# EAGLE schematic SCX3 (EAGLE 7.7.0)
PROJECT_NAME: ServoControllerX3; VERSION: 1.2.0

## Sheet 1 of 7: Power P
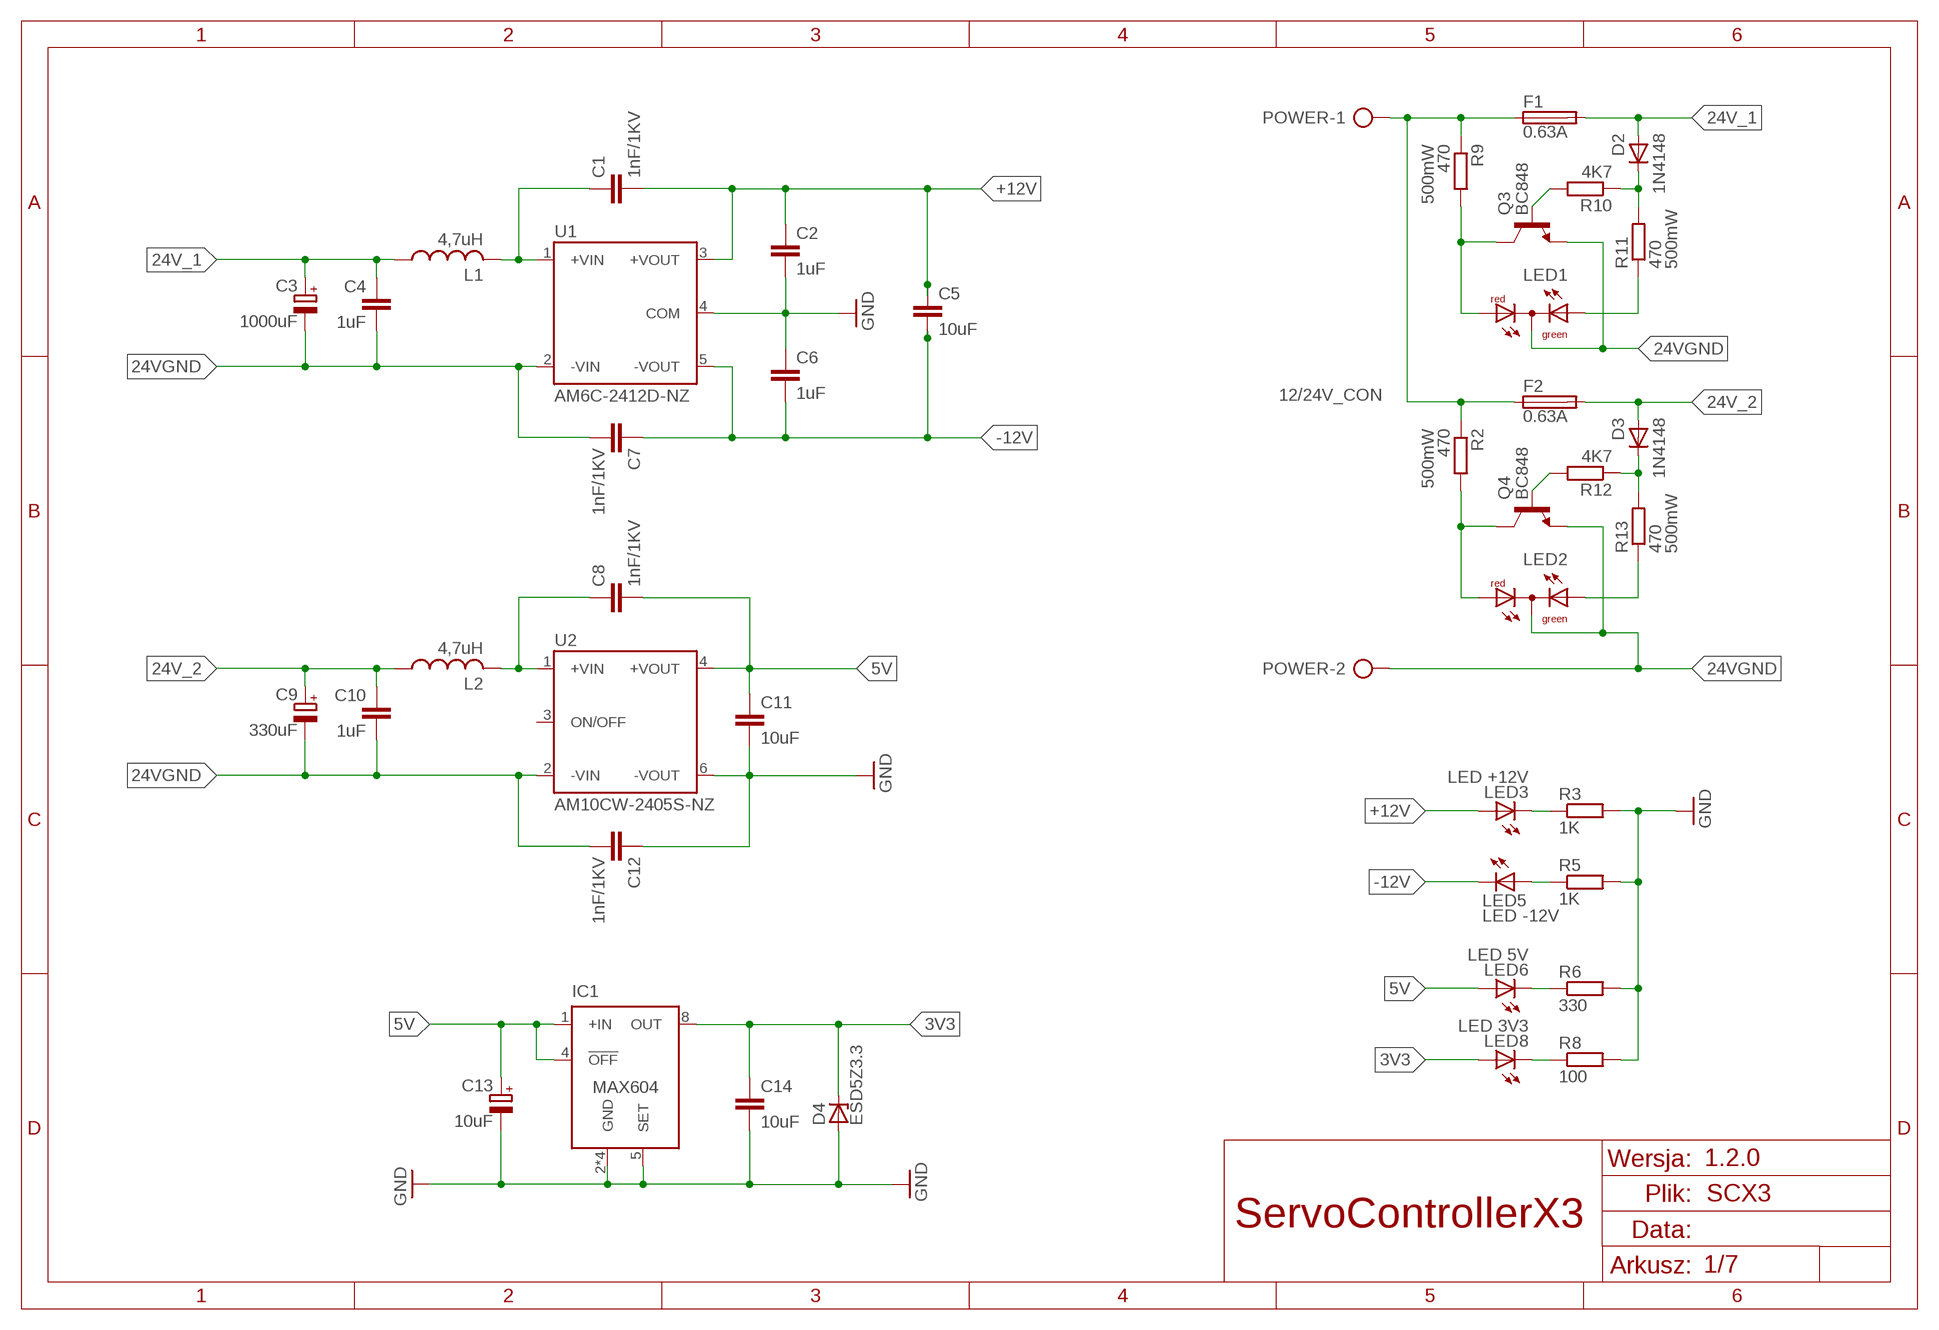
[diagram p0: schematic, sheet 1]

### Parts
C1  1nF/1KV  C-EUC1206  [C1206]
C2  1uF  C-EUC0805  [C0805]
C3  1000uF  CPOL-EUE5-10.5  [E5-10,5]
C4  1uF  C-EUC0805  [C0805]
C5  10uF  C-EUC0805  [C0805]
C6  1uF  C-EUC0805  [C0805]
C7  1nF/1KV  C-EUC1206  [C1206]
C8  1nF/1KV  C-EUC1206  [C1206]
C9  330uF  CPOL-EUE5-10.5  [E5-10,5]
C10  1uF  C-EUC0805  [C0805]
C11  10uF  C-EUC0805  [C0805]
C12  1nF/1KV  C-EUC1206  [C1206]
C13  10uF  CPOL-EUUD-4X5,8  [UD-4X5,8_NICHICON]
C14  10uF  C-EUC0805  [C0805]
D2  1N4148  1N4148SMD-0805  [D0805]
D3  1N4148  1N4148SMD-0805  [D0805]
D4  ESD5Z3.3  ZENER-DIODESOD523  [SOD523]
F1  0.63A  TR5  [TR5]
F2  0.63A  TR5  [TR5]
IC1  MAX604  [DIL08]
L1  4,7uH  DJNR6028--S  [DJNR6028]
L2  4,7uH  DJNR6028--S  [DJNR6028]
LED1  DUOLED-RG-C  [DUOLED-C-5MM]
LED2  DUOLED-RG-C  [DUOLED-C-5MM]
LED3  LED +12V  LEDSML1206  [SML1206]
LED5  LED -12V  LEDSML1206  [SML1206]
LED6  LED 5V  LEDSML1206  [SML1206]
LED8  LED 3V3  LEDSML1206  [SML1206]
POWER  12/24V_CON  AK500/2  [AK500/2]
Q3  BC848  BC848SMD  [SOT23]
Q4  BC848  BC848SMD  [SOT23]
R2  470  R-EU_R1206  [R1206]
R3  1K  R-EU_R0805  [R0805]
R5  1K  R-EU_R0805  [R0805]
R6  330  R-EU_R0805  [R0805]
R8  100  R-EU_R0805  [R0805]
R9  470  R-EU_R1206  [R1206]
R10  4K7  R-EU_R0805  [R0805]
R11  470  R-EU_R1206  [R1206]
R12  4K7  R-EU_R0805  [R0805]
R13  470  R-EU_R1206  [R1206]
U1  AM6C-2412D-NZ  [AM6C]
U2  AM10CW-2405S-NZ  [AM10CW-NZ]

### Nets
3V3: C14.1 D4.C IC1.8(OUT) LED8.A ; also sheet 2,3,4,6,7
5V: C8.2 C11.1 C13.+ IC1.1(+IN) IC1.4(!OFF) LED6.A U2.4(+VOUT) ; also sheet 2,3,4
24V_1: C3.+ C4.1 D2.1(A) F1.2 L1.A
24V_2: C9.+ C10.1 D3.1(A) F2.2 L2.A
24V_SUPPLY: F1.1 F2.1 POWER.1 R2.1 R9.1
24VGND [24V]: C3.- C4.2 C7.2 C9.- C10.2 C12.2 LED1.C LED2.C POWER.2 Q3.2(E) Q4.2(E) U1.2(-VIN) U2.2(-VIN)
+12V [12V]: C1.2 C2.1 C5.1 LED3.A U1.3(+VOUT) ; also sheet 5
-12V [12V]: C5.2 C6.2 C7.1 LED5.C U1.5(-VOUT) ; also sheet 5
GND: C2.2 C6.1 C11.2 C12.1 C13.- C14.2 D4.A IC1.2(GND) IC1.3(GND) IC1.5(SET) IC1.6(GND) IC1.7(GND) R3.2 R5.2 R6.2 R8.2 U1.4(COM) U2.6(-VOUT) ; also sheet 2,3,4,5,6,7
N$4: C8.1 L2.B U2.1(+VIN)
N$46: C1.1 L1.B U1.1(+VIN)
N$49: LED1.AR Q3.3(C) R9.2
N$57: Q3.1(B) R10.2
N$58: LED3.C R3.1
N$59: LED1.AX(AG) R11.1
N$60: D2.2(C) R10.1 R11.2
N$61: LED2.AR Q4.3(C) R2.2
N$65: LED6.C R6.1
N$66: Q4.1(B) R12.2
N$68: LED2.AX(AG) R13.1
N$75: LED8.C R8.1
N$76: LED5.A R5.1
N$77: D3.2(C) R12.1 R13.2
Unconnected: U2.3(ON/OFF)

## Sheet 2 of 7: I/O interface
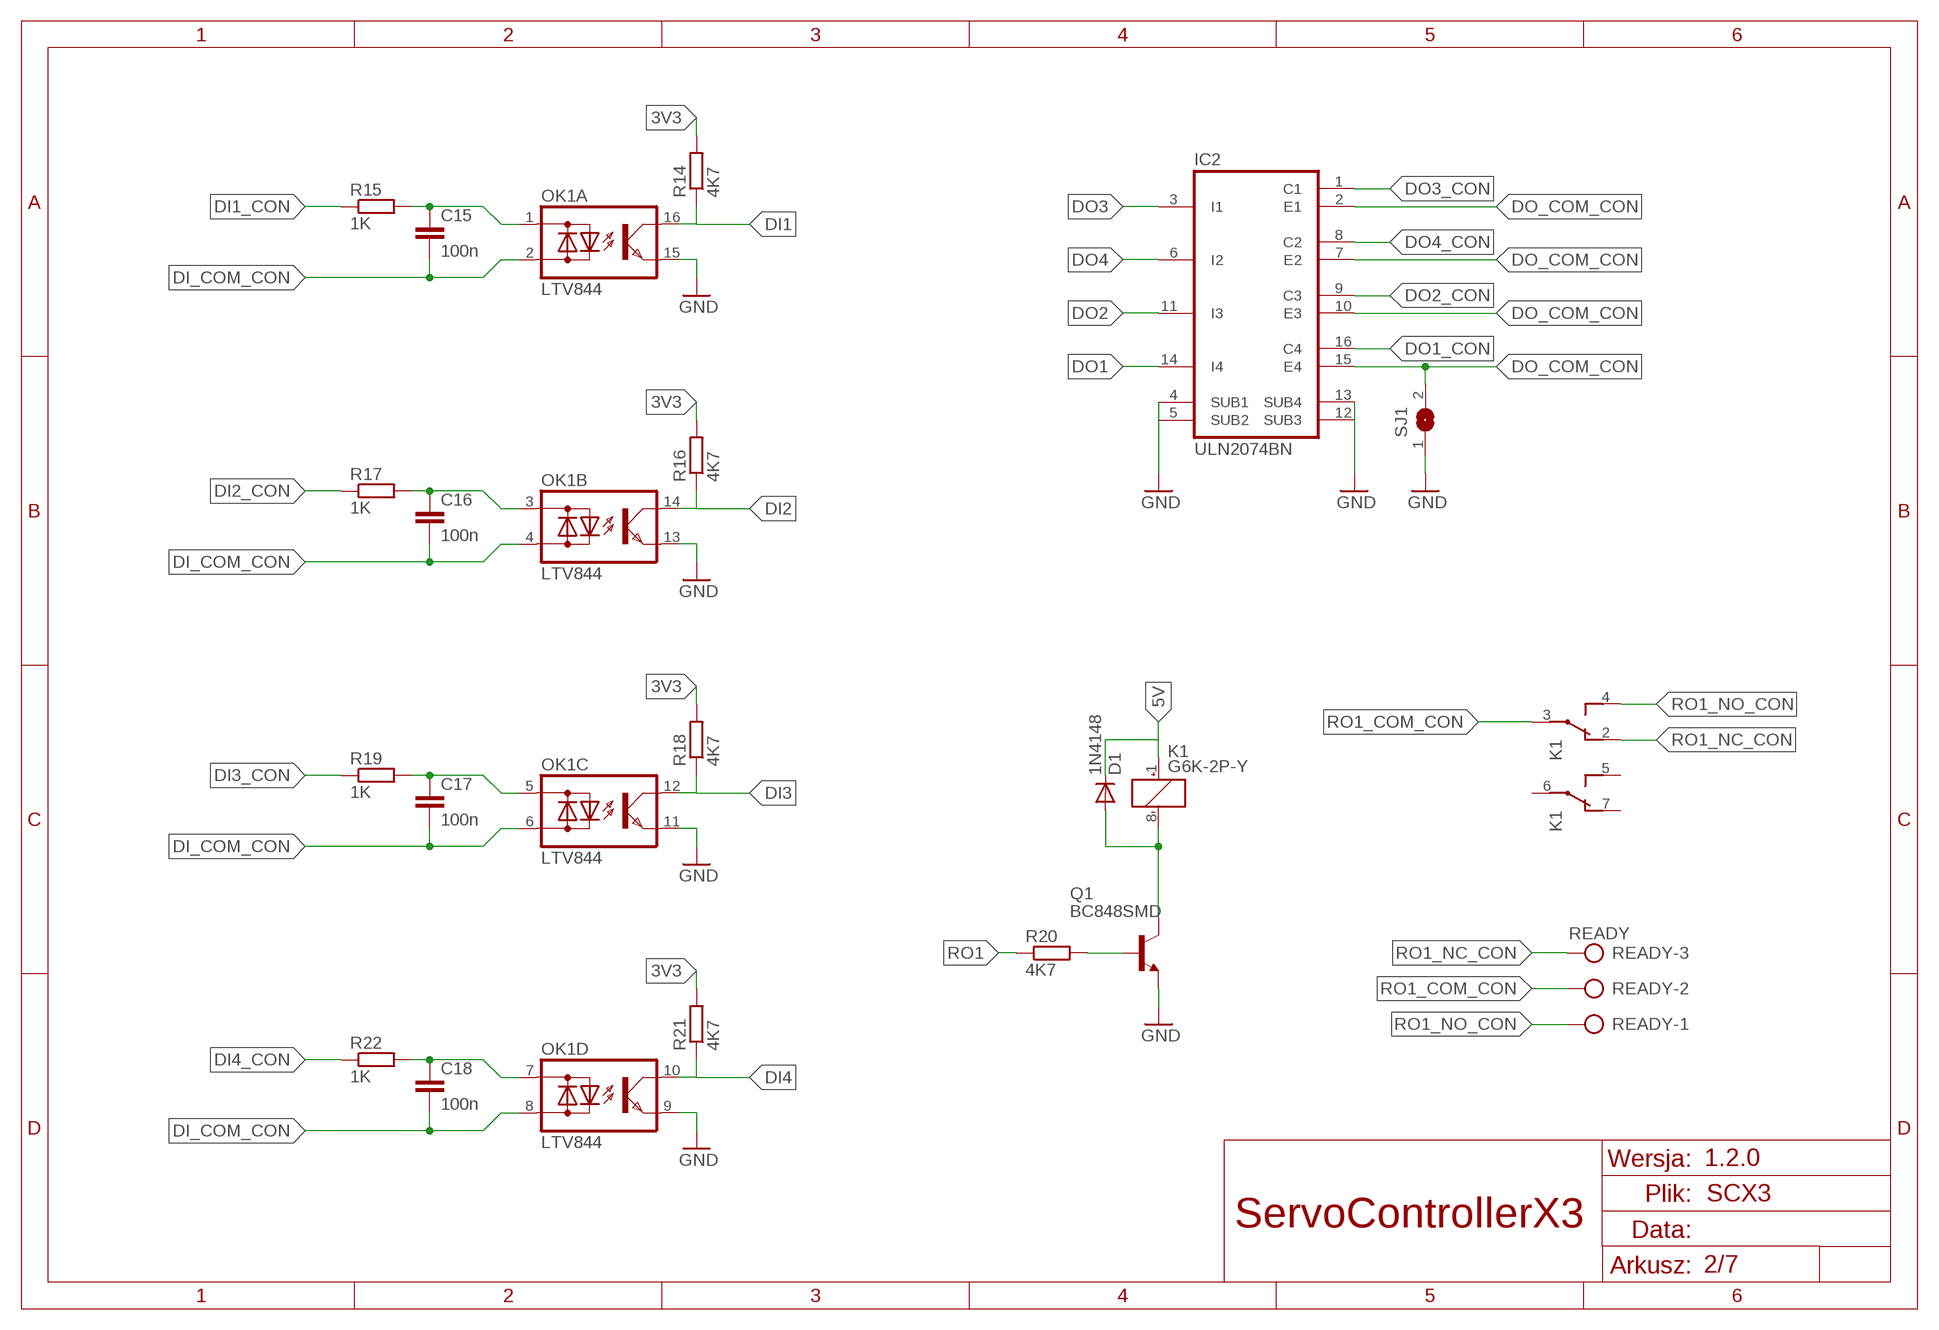
[diagram p1: schematic, sheet 2]

### Parts
C15  100n  C-EUC0805  [C0805]
C16  100n  C-EUC0805  [C0805]
C17  100n  C-EUC0805  [C0805]
C18  100n  C-EUC0805  [C0805]
D1  1N4148  1N4148SMD-0805  [D0805]
IC2  ULN2074BN  [DIL16]
K1  G6K-2P-Y  [G6K-2P-Y]
OK1  LTV844  [DIL16]
Q1  BC848SMD  [SOT23]
R14  4K7  R-EU_R0805  [R0805]
R15  1K  R-EU_R0805  [R0805]
R16  4K7  R-EU_R0805  [R0805]
R17  1K  R-EU_R0805  [R0805]
R18  4K7  R-EU_R0805  [R0805]
R19  1K  R-EU_R0805  [R0805]
R20  4K7  R-EU_R0805  [R0805]
R21  4K7  R-EU_R0805  [R0805]
R22  1K  R-EU_R0805  [R0805]
READY  READY  AK500/3  [AK500/3]
SJ1  SJ  [SJ]

### Nets
3V3: R14.2 R16.2 R18.2 R21.2 ; also sheet 1,3,4,6,7
5V: D1.2(C) K1.1(1:+) ; also sheet 1,3,4
DI1: OK1.16(A:C) R14.1 ; also sheet 7
DI1_CON: R15.1 ; also sheet 3
DI2: OK1.14(B:C) R16.1 ; also sheet 7
DI2_CON: R17.1 ; also sheet 3
DI3: OK1.12(C:C) R18.1 ; also sheet 7
DI3_CON: R19.1 ; also sheet 3
DI4: OK1.10(D:C) R21.1 ; also sheet 7
DI4_CON: R22.1 ; also sheet 3
DI_COM_CON: C15.2 C16.2 C17.2 C18.2 OK1.2(A:AC2) OK1.4(B:AC2) OK1.6(C:AC2) OK1.8(D:AC2) ; also sheet 3
DO1: IC2.14(I4) ; also sheet 7
DO1_CON: IC2.16(C4) ; also sheet 3
DO2: IC2.11(I3) ; also sheet 7
DO2_CON: IC2.9(C3) ; also sheet 3
DO3: IC2.3(I1) ; also sheet 7
DO3_CON: IC2.1(C1) ; also sheet 3
DO4: IC2.6(I2) ; also sheet 7
DO4_CON: IC2.8(C2) ; also sheet 3
DO_COM_CON: IC2.2(E1) IC2.7(E2) IC2.10(E3) IC2.15(E4) SJ1.2 ; also sheet 3
GND: IC2.4(SUB1) IC2.5(SUB2) IC2.12(SUB3) IC2.13(SUB4) OK1.9(D:E) OK1.11(C:E) OK1.13(B:E) OK1.15(A:E) Q1.2(E) SJ1.1 ; also sheet 1,3,4,5,6,7
N$12: D1.1(A) K1.8(1:-) Q1.3(C)
N$56: C16.1 OK1.3(B:AC1) R17.2
N$69: Q1.1(B) R20.2
N$70: C17.1 OK1.5(C:AC1) R19.2
N$71: C18.1 OK1.7(D:AC1) R22.2
N$72: C15.1 OK1.1(A:AC1) R15.2
RO1: R20.1 ; also sheet 7
RO1_COM_CON: K1.3(2:P) READY.2
RO1_NC_CON: K1.2(2:O) READY.3
RO1_NO_CON: K1.4(2:S) READY.1
Unconnected: K1.5(3:S) K1.6(3:P) K1.7(3:O)

## Sheet 3 of 7: Position interface
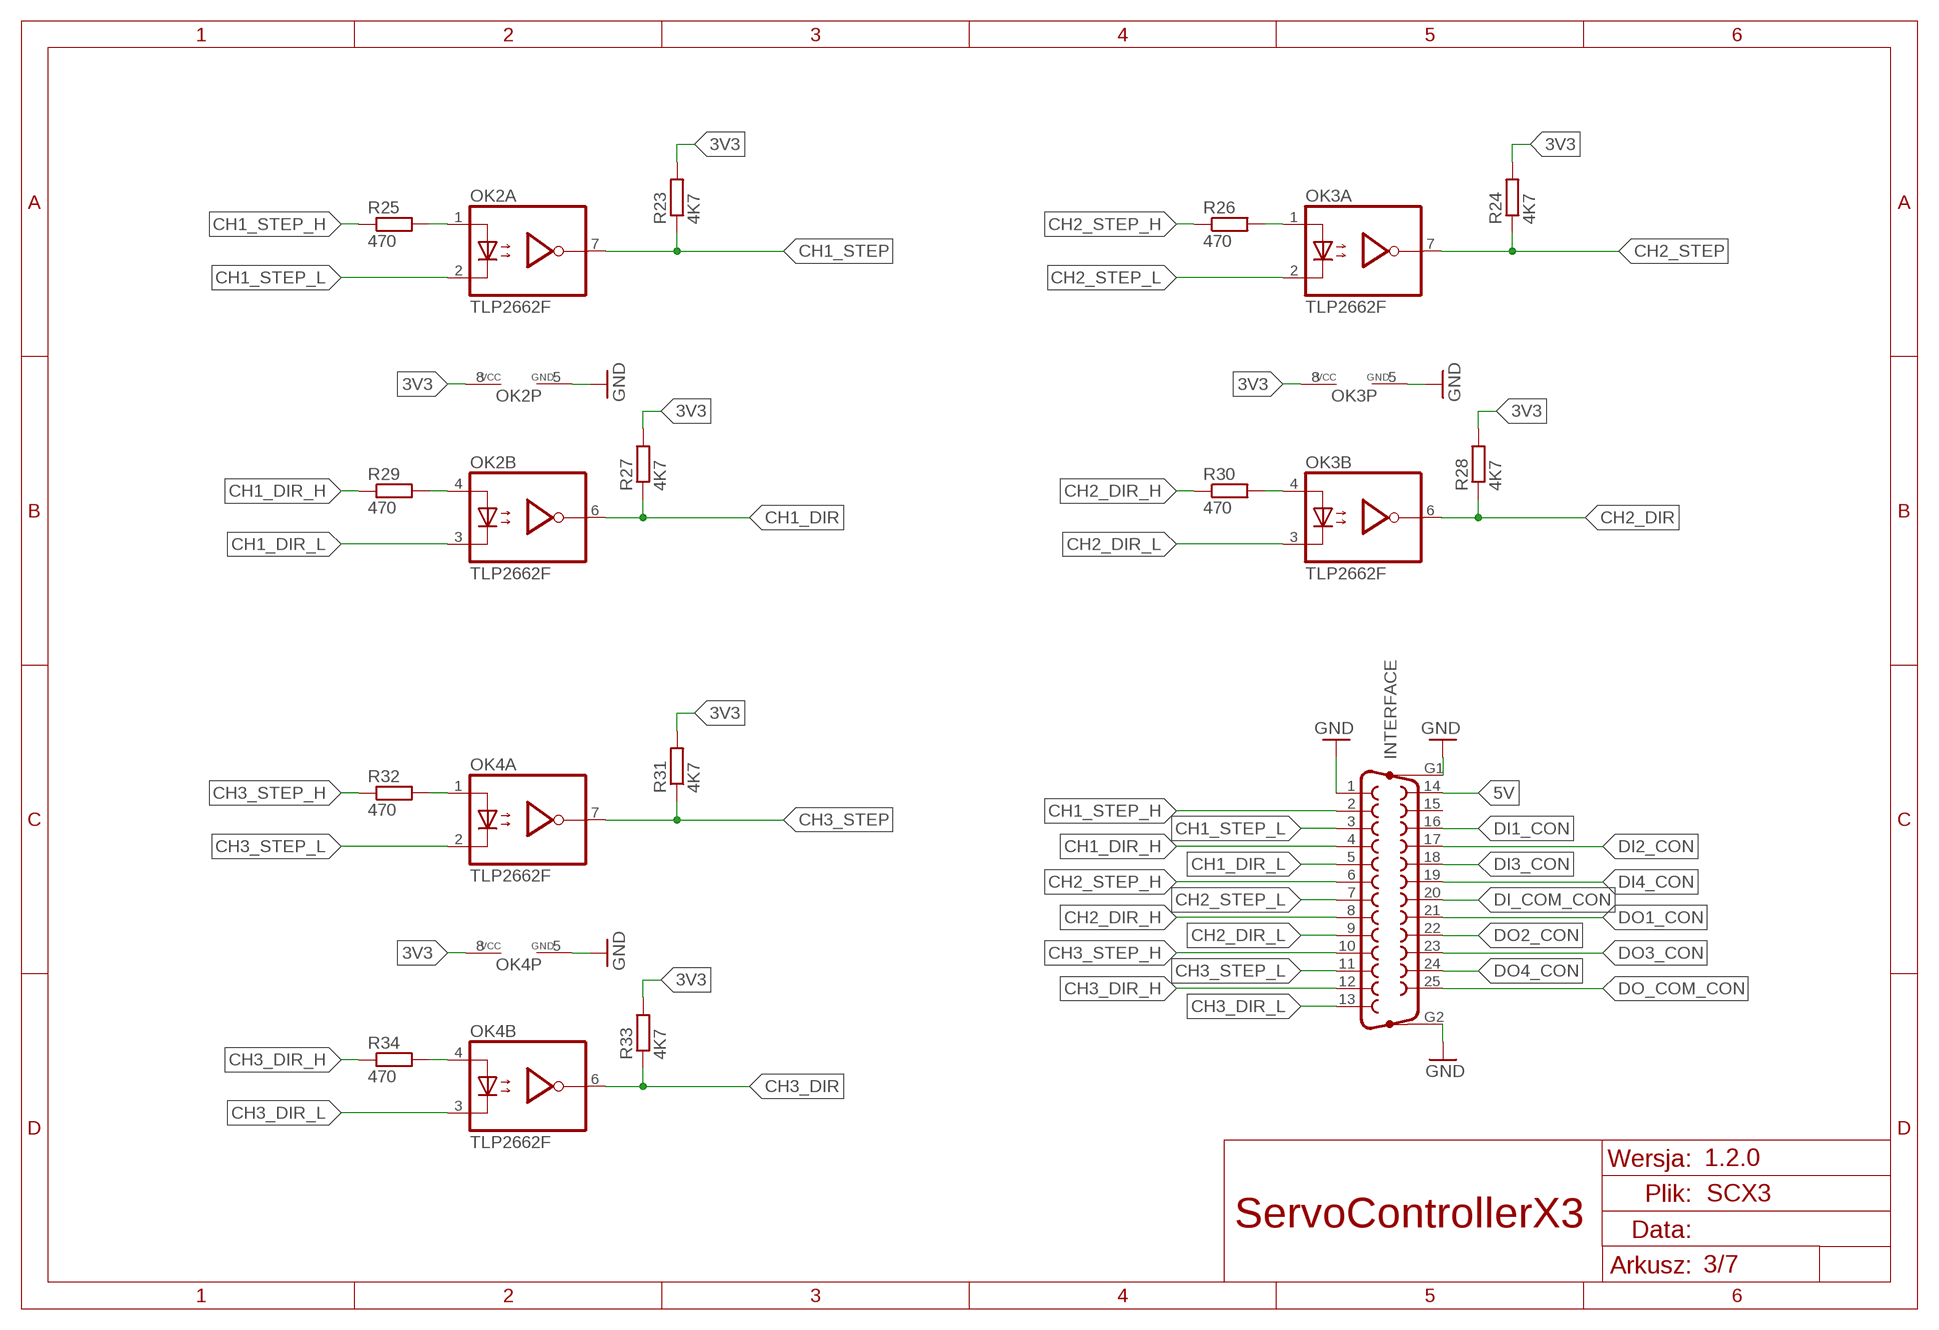
[diagram p2: schematic, sheet 3]

### Parts
INTERFACE  F25VP  [F25VP]
OK2  TLP2662F  [DIL08]
OK3  TLP2662F  [DIL08]
OK4  TLP2662F  [DIL08]
R23  4K7  R-EU_R0805  [R0805]
R24  4K7  R-EU_R0805  [R0805]
R25  470  R-EU_R0805  [R0805]
R26  470  R-EU_R0805  [R0805]
R27  4K7  R-EU_R0805  [R0805]
R28  4K7  R-EU_R0805  [R0805]
R29  470  R-EU_R0805  [R0805]
R30  470  R-EU_R0805  [R0805]
R31  4K7  R-EU_R0805  [R0805]
R32  470  R-EU_R0805  [R0805]
R33  4K7  R-EU_R0805  [R0805]
R34  470  R-EU_R0805  [R0805]

### Nets
3V3: OK2.8(P:VCC) OK3.8(P:VCC) OK4.8(P:VCC) R23.2 R24.2 R27.2 R28.2 R31.2 R33.2 ; also sheet 1,2,4,6,7
5V: INTERFACE.14 ; also sheet 1,2,4
CH1_DIR: OK2.6(B:VO) R27.1 ; also sheet 7
CH1_DIR_H: INTERFACE.4 R29.1
CH1_DIR_L: INTERFACE.5 OK2.3(B:C)
CH1_STEP: OK2.7(A:VO) R23.1 ; also sheet 7
CH1_STEP_H [SIGNAL]: INTERFACE.2 R25.1
CH1_STEP_L: INTERFACE.3 OK2.2(A:C)
CH2_DIR: OK3.6(B:VO) R28.1 ; also sheet 7
CH2_DIR_H: INTERFACE.8 R30.1
CH2_DIR_L: INTERFACE.9 OK3.3(B:C)
CH2_STEP [SIGNAL]: OK3.7(A:VO) R24.1 ; also sheet 7
CH2_STEP_H: INTERFACE.6 R26.1
CH2_STEP_L: INTERFACE.7 OK3.2(A:C)
CH3_DIR: OK4.6(B:VO) R33.1 ; also sheet 7
CH3_DIR_H: INTERFACE.12 R34.1
CH3_DIR_L: INTERFACE.13 OK4.3(B:C)
CH3_STEP: OK4.7(A:VO) R31.1 ; also sheet 7
CH3_STEP_H: INTERFACE.10 R32.1
CH3_STEP_L: INTERFACE.11 OK4.2(A:C)
DI1_CON: INTERFACE.16 ; also sheet 2
DI2_CON: INTERFACE.17 ; also sheet 2
DI3_CON: INTERFACE.18 ; also sheet 2
DI4_CON: INTERFACE.19 ; also sheet 2
DI_COM_CON: INTERFACE.20 ; also sheet 2
DO1_CON: INTERFACE.21 ; also sheet 2
DO2_CON: INTERFACE.22 ; also sheet 2
DO3_CON: INTERFACE.23 ; also sheet 2
DO4_CON: INTERFACE.24 ; also sheet 2
DO_COM_CON: INTERFACE.25 ; also sheet 2
GND: INTERFACE.1 INTERFACE.G1 INTERFACE.G2 OK2.5(P:GND) OK3.5(P:GND) OK4.5(P:GND) ; also sheet 1,2,4,5,6,7
N$16: OK3.4(B:A) R30.2
N$17: OK3.1(A:A) R26.2
N$18: OK4.4(B:A) R34.2
N$19: OK4.1(A:A) R32.2
N$73: OK2.4(B:A) R29.2
N$74: OK2.1(A:A) R25.2
Unconnected: INTERFACE.15

## Sheet 4 of 7: Encoder interface
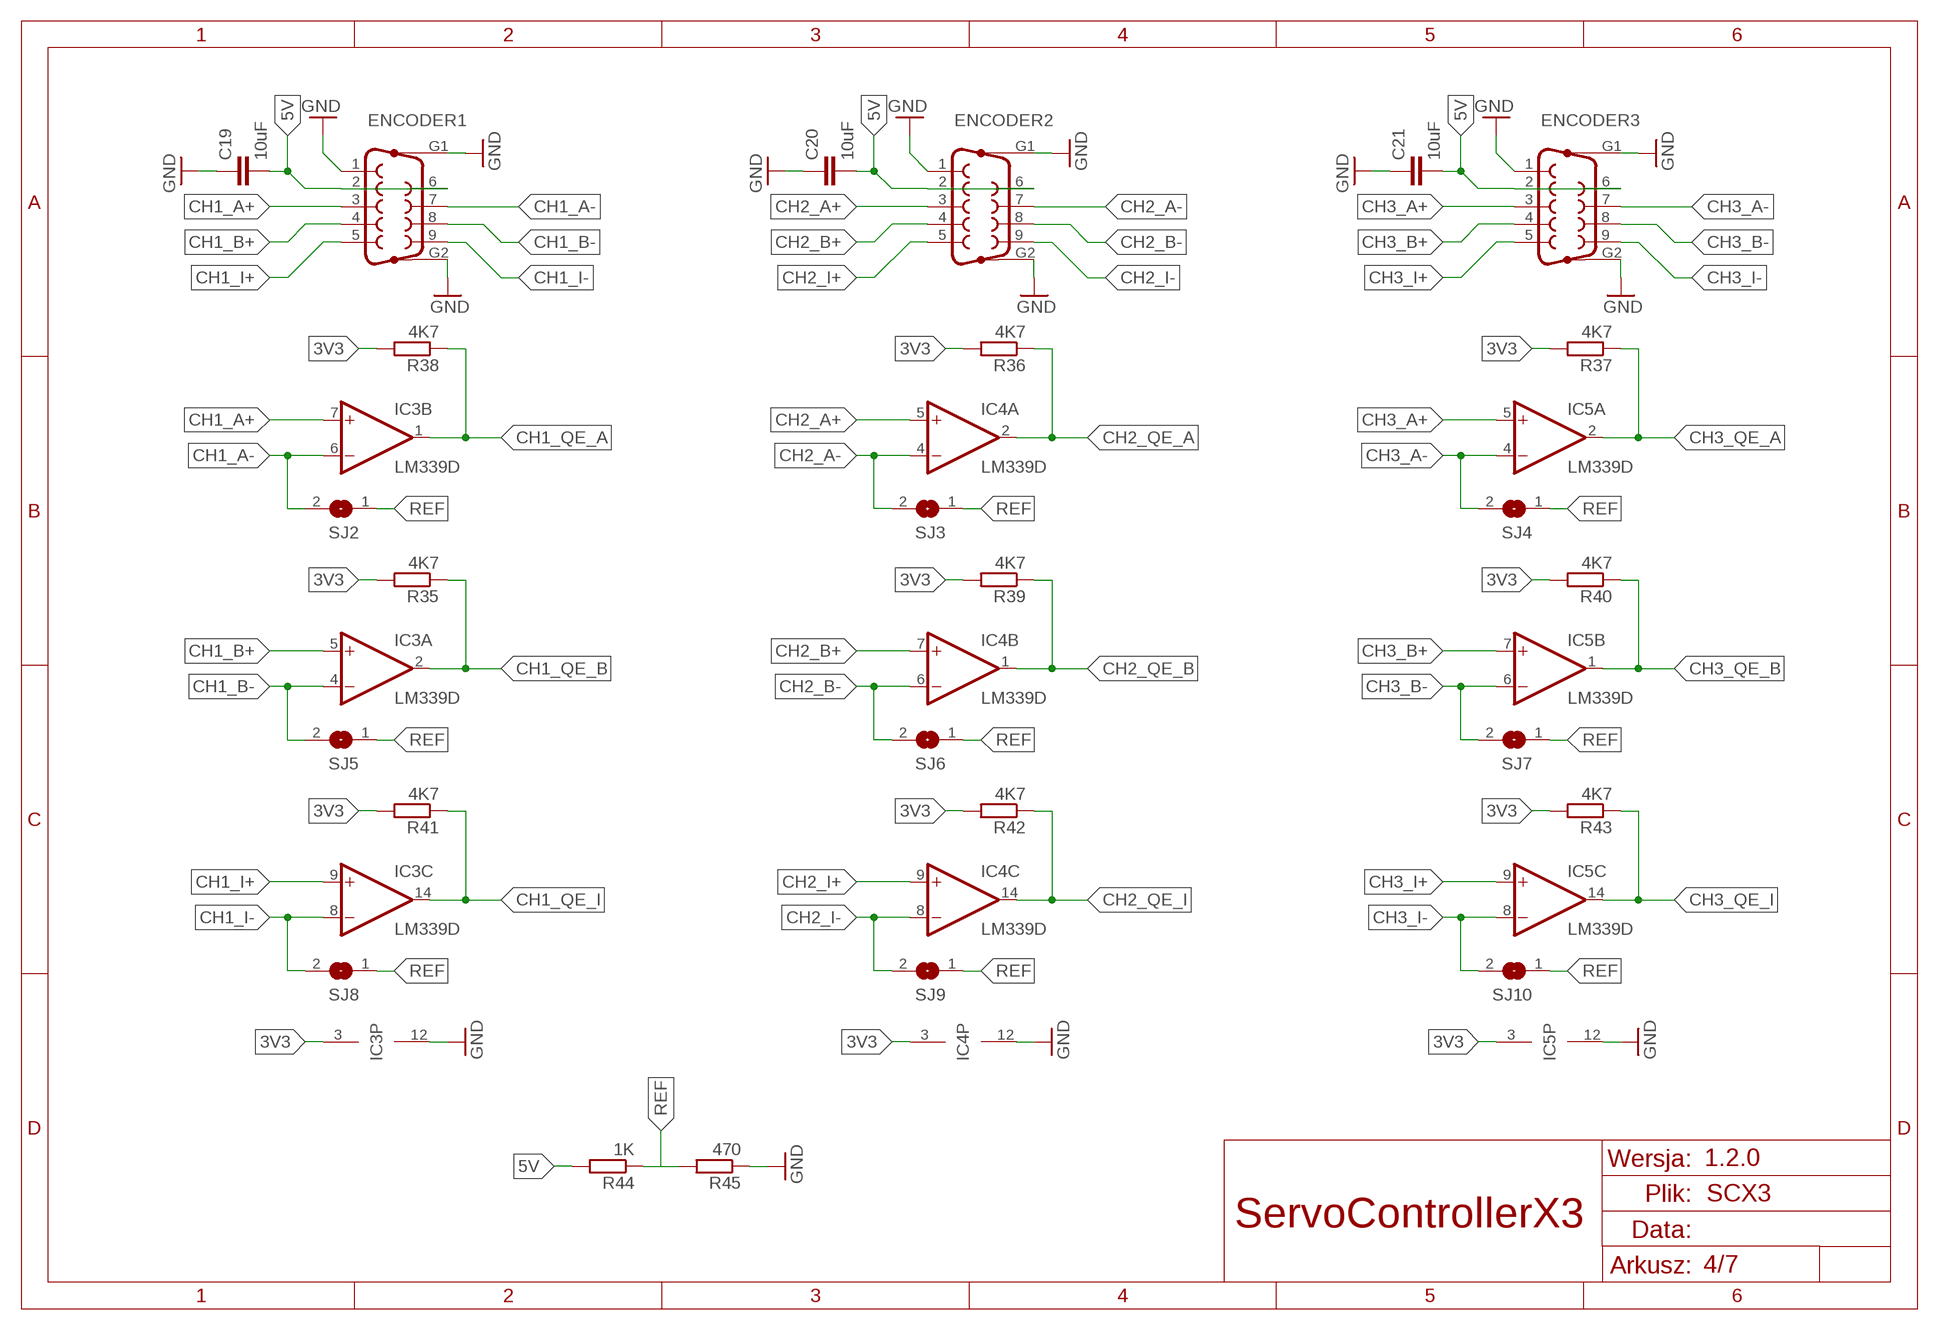
[diagram p3: schematic, sheet 4]

### Parts
C19  10uF  C-EUC0805  [C0805]
C20  10uF  C-EUC0805  [C0805]
C21  10uF  C-EUC0805  [C0805]
ENCODER1  F09VP  [F09VP]
ENCODER2  F09VP  [F09VP]
ENCODER3  F09VP  [F09VP]
IC3  LM339D  [SO14]
IC4  LM339D  [SO14]
IC5  LM339D  [SO14]
R35  4K7  R-EU_R0805  [R0805]
R36  4K7  R-EU_R0805  [R0805]
R37  4K7  R-EU_R0805  [R0805]
R38  4K7  R-EU_R0805  [R0805]
R39  4K7  R-EU_R0805  [R0805]
R40  4K7  R-EU_R0805  [R0805]
R41  4K7  R-EU_R0805  [R0805]
R42  4K7  R-EU_R0805  [R0805]
R43  4K7  R-EU_R0805  [R0805]
R44  1K  R-EU_R0805  [R0805]
R45  470  R-EU_R0805  [R0805]
SJ2  SJ  [SJ]
SJ3  SJ  [SJ]
SJ4  SJ  [SJ]
SJ5  SJ  [SJ]
SJ6  SJ  [SJ]
SJ7  SJ  [SJ]
SJ8  SJ  [SJ]
SJ9  SJ  [SJ]
SJ10  SJ  [SJ]

### Nets
3V3: IC3.3(P:V+) IC4.3(P:V+) IC5.3(P:V+) R35.2 R36.2 R37.2 R38.2 R39.2 R40.2 R41.2 R42.2 R43.2 ; also sheet 1,2,3,6,7
5V: C19.2 C20.2 C21.2 ENCODER1.2 ENCODER1.6 ENCODER2.2 ENCODER2.6 ENCODER3.2 ENCODER3.6 R44.2 ; also sheet 1,2,3
CH1_A+: ENCODER1.3 IC3.7(B:+IN)
CH1_A-: ENCODER1.7 IC3.6(B:-IN) SJ2.2
CH1_B+: ENCODER1.4 IC3.5(A:+IN)
CH1_B-: ENCODER1.8 IC3.4(A:-IN) SJ5.2
CH1_I+: ENCODER1.5 IC3.9(C:+IN)
CH1_I-: ENCODER1.9 IC3.8(C:-IN) SJ8.2
CH1_QE_A: IC3.1(B:OUT) R38.1 ; also sheet 7
CH1_QE_B: IC3.2(A:OUT) R35.1 ; also sheet 7
CH1_QE_I: IC3.14(C:OUT) R41.1 ; also sheet 7
CH2_A+: ENCODER2.3 IC4.5(A:+IN)
CH2_A-: ENCODER2.7 IC4.4(A:-IN) SJ3.2
CH2_B+: ENCODER2.4 IC4.7(B:+IN)
CH2_B-: ENCODER2.8 IC4.6(B:-IN) SJ6.2
CH2_I+: ENCODER2.5 IC4.9(C:+IN)
CH2_I-: ENCODER2.9 IC4.8(C:-IN) SJ9.2
CH2_QE_A: IC4.2(A:OUT) R36.1 ; also sheet 7
CH2_QE_B: IC4.1(B:OUT) R39.1 ; also sheet 7
CH2_QE_I: IC4.14(C:OUT) R42.1 ; also sheet 7
CH3_A+: ENCODER3.3 IC5.5(A:+IN)
CH3_A-: ENCODER3.7 IC5.4(A:-IN) SJ4.2
CH3_B+: ENCODER3.4 IC5.7(B:+IN)
CH3_B-: ENCODER3.8 IC5.6(B:-IN) SJ7.2
CH3_I+: ENCODER3.5 IC5.9(C:+IN)
CH3_I-: ENCODER3.9 IC5.8(C:-IN) SJ10.2
CH3_QE_A: IC5.2(A:OUT) R37.1 ; also sheet 7
CH3_QE_B: IC5.1(B:OUT) R40.1 ; also sheet 7
CH3_QE_I: IC5.14(C:OUT) R43.1 ; also sheet 7
GND: C19.1 C20.1 C21.1 ENCODER1.1 ENCODER1.G1 ENCODER1.G2 ENCODER2.1 ENCODER2.G1 ENCODER2.G2 ENCODER3.1 ENCODER3.G1 ENCODER3.G2 IC3.12(P:GND) IC4.12(P:GND) IC5.12(P:GND) R45.1 ; also sheet 1,2,3,5,6,7
REF: R44.1 R45.2 SJ2.1 SJ3.1 SJ4.1 SJ5.1 SJ6.1 SJ7.1 SJ8.1 SJ9.1 SJ10.1
Unconnected: IC3.10(D:-IN) IC3.11(D:+IN) IC3.13(D:OUT) IC4.10(D:-IN) IC4.11(D:+IN) IC4.13(D:OUT) IC5.10(D:-IN) IC5.11(D:+IN) IC5.13(D:OUT)

## Sheet 5 of 7: +/-10V interface
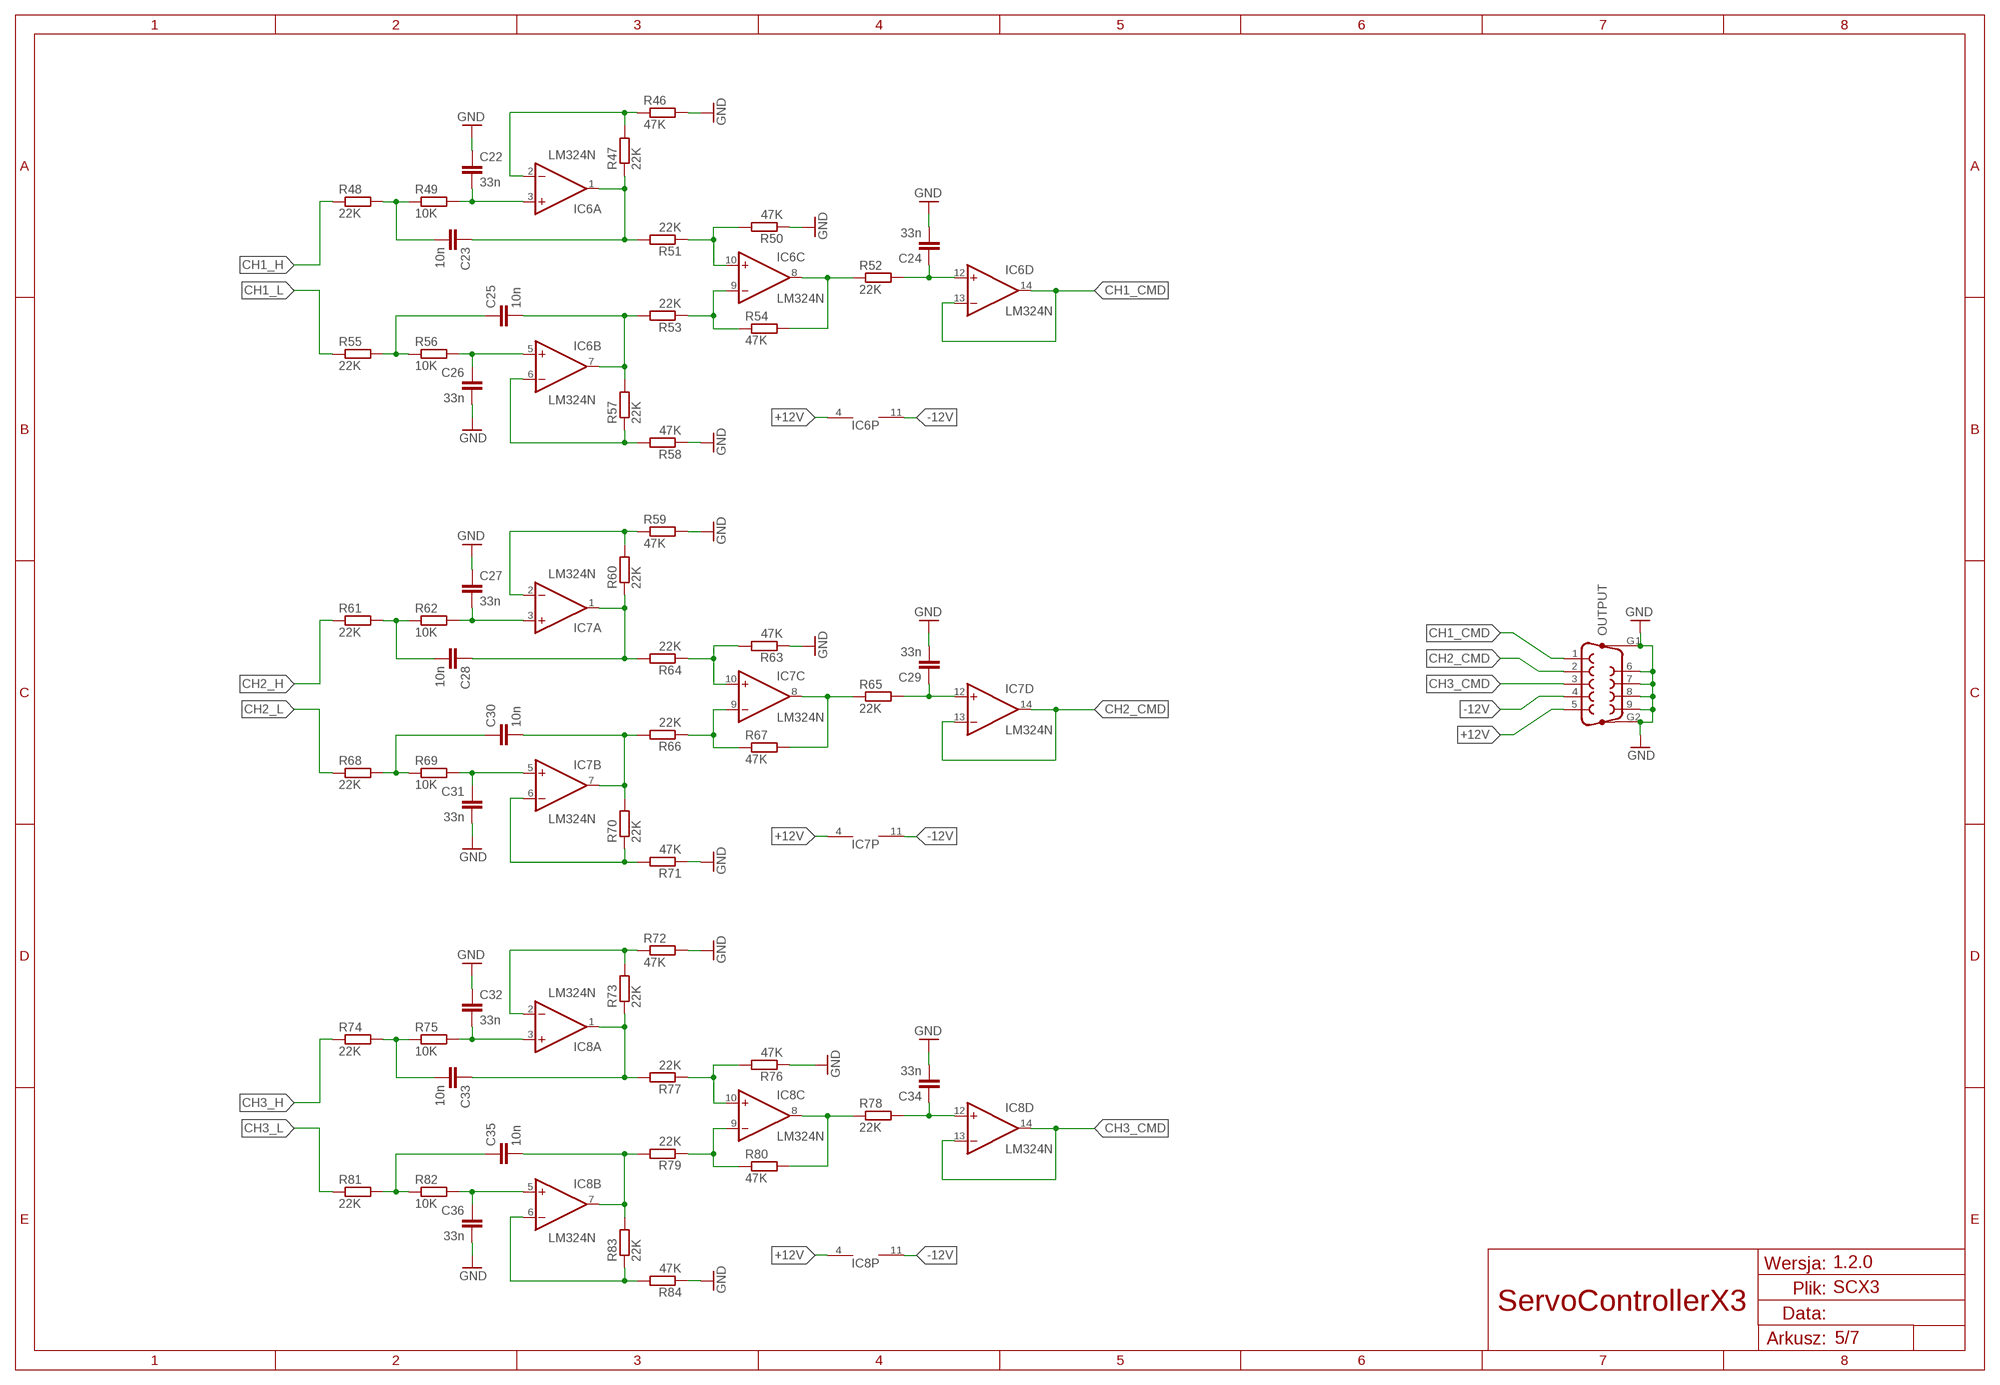
[diagram p4: schematic, sheet 5]

### Parts
C22  33n  C-EUC0805  [C0805]
C23  10n  C-EUC0805  [C0805]
C24  33n  C-EUC0805  [C0805]
C25  10n  C-EUC0805  [C0805]
C26  33n  C-EUC0805  [C0805]
C27  33n  C-EUC0805  [C0805]
C28  10n  C-EUC0805  [C0805]
C29  33n  C-EUC0805  [C0805]
C30  10n  C-EUC0805  [C0805]
C31  33n  C-EUC0805  [C0805]
C32  33n  C-EUC0805  [C0805]
C33  10n  C-EUC0805  [C0805]
C34  33n  C-EUC0805  [C0805]
C35  10n  C-EUC0805  [C0805]
C36  33n  C-EUC0805  [C0805]
IC6  LM324N  [DIL14]
IC7  LM324N  [DIL14]
IC8  LM324N  [DIL14]
OUTPUT  F09VP  [F09VP]
R46  47K  R-EU_R0805  [R0805]
R47  22K  R-EU_R0805  [R0805]
R48  22K  R-EU_R0805  [R0805]
R49  10K  R-EU_R0805  [R0805]
R50  47K  R-EU_R0805  [R0805]
R51  22K  R-EU_R0805  [R0805]
R52  22K  R-EU_R0805  [R0805]
R53  22K  R-EU_R0805  [R0805]
R54  47K  R-EU_R0805  [R0805]
R55  22K  R-EU_R0805  [R0805]
R56  10K  R-EU_R0805  [R0805]
R57  22K  R-EU_R0805  [R0805]
R58  47K  R-EU_R0805  [R0805]
R59  47K  R-EU_R0805  [R0805]
R60  22K  R-EU_R0805  [R0805]
R61  22K  R-EU_R0805  [R0805]
R62  10K  R-EU_R0805  [R0805]
R63  47K  R-EU_R0805  [R0805]
R64  22K  R-EU_R0805  [R0805]
R65  22K  R-EU_R0805  [R0805]
R66  22K  R-EU_R0805  [R0805]
R67  47K  R-EU_R0805  [R0805]
R68  22K  R-EU_R0805  [R0805]
R69  10K  R-EU_R0805  [R0805]
R70  22K  R-EU_R0805  [R0805]
R71  47K  R-EU_R0805  [R0805]
R72  47K  R-EU_R0805  [R0805]
R73  22K  R-EU_R0805  [R0805]
R74  22K  R-EU_R0805  [R0805]
R75  10K  R-EU_R0805  [R0805]
R76  47K  R-EU_R0805  [R0805]
R77  22K  R-EU_R0805  [R0805]
R78  22K  R-EU_R0805  [R0805]
R79  22K  R-EU_R0805  [R0805]
R80  47K  R-EU_R0805  [R0805]
R81  22K  R-EU_R0805  [R0805]
R82  10K  R-EU_R0805  [R0805]
R83  22K  R-EU_R0805  [R0805]
R84  47K  R-EU_R0805  [R0805]

### Nets
+12V [12V]: IC6.4(P:V+) IC7.4(P:V+) IC8.4(P:V+) OUTPUT.5 ; also sheet 1
-12V [12V]: IC6.11(P:V-) IC7.11(P:V-) IC8.11(P:V-) OUTPUT.4 ; also sheet 1
CH1_CMD: IC6.13(D:-IN) IC6.14(D:OUT) OUTPUT.1
CH1_H: R48.1 ; also sheet 7
CH1_L: R55.1 ; also sheet 7
CH2_CMD: IC7.13(D:-IN) IC7.14(D:OUT) OUTPUT.2
CH2_H: R61.1 ; also sheet 7
CH2_L: R68.1 ; also sheet 7
CH3_CMD: IC8.13(D:-IN) IC8.14(D:OUT) OUTPUT.3
CH3_H: R74.1 ; also sheet 7
CH3_L: R81.1 ; also sheet 7
GND: C22.1 C24.2 C26.2 C27.1 C29.2 C31.2 C32.1 C34.2 C36.2 OUTPUT.6 OUTPUT.7 OUTPUT.8 OUTPUT.9 OUTPUT.G1 OUTPUT.G2 R46.2 R50.1 R58.1 R59.2 R63.1 R71.1 R72.2 R76.1 R84.1 ; also sheet 1,2,3,4,6,7
N$1: IC6.6(B:-IN) R57.1 R58.2
N$2: IC6.2(A:-IN) R46.1 R47.2
N$5: C23.1 IC6.1(A:OUT) R47.1 R51.2
N$6: C22.2 IC6.3(A:+IN) R49.2
N$7: C23.2 R48.2 R49.1
N$8: C24.1 IC6.12(D:+IN) R52.2
N$9: IC6.8(C:OUT) R52.1 R54.2
N$10: IC6.9(C:-IN) R53.1 R54.1
N$11: C25.2 IC6.7(B:OUT) R53.2 R57.2
N$13: C26.1 IC6.5(B:+IN) R56.2
N$14: C25.1 R55.2 R56.1
N$15: IC6.10(C:+IN) R50.2 R51.1
N$20: IC7.6(B:-IN) R70.1 R71.2
N$21: IC7.2(A:-IN) R59.1 R60.2
N$22: C28.1 IC7.1(A:OUT) R60.1 R64.2
N$23: C27.2 IC7.3(A:+IN) R62.2
N$24: C28.2 R61.2 R62.1
N$25: C29.1 IC7.12(D:+IN) R65.2
N$26: IC7.8(C:OUT) R65.1 R67.2
N$27: IC7.9(C:-IN) R66.1 R67.1
N$28: C30.2 IC7.7(B:OUT) R66.2 R70.2
N$29: C31.1 IC7.5(B:+IN) R69.2
N$30: C30.1 R68.2 R69.1
N$31: IC7.10(C:+IN) R63.2 R64.1
N$32: IC8.6(B:-IN) R83.1 R84.2
N$33: IC8.2(A:-IN) R72.1 R73.2
N$34: C33.1 IC8.1(A:OUT) R73.1 R77.2
N$35: C32.2 IC8.3(A:+IN) R75.2
N$36: C33.2 R74.2 R75.1
N$37: C34.1 IC8.12(D:+IN) R78.2
N$38: IC8.8(C:OUT) R78.1 R80.2
N$39: IC8.9(C:-IN) R79.1 R80.1
N$40: C35.2 IC8.7(B:OUT) R79.2 R83.2
N$41: C36.1 IC8.5(B:+IN) R82.2
N$42: C35.1 R81.2 R82.1
N$43: IC8.10(C:+IN) R76.2 R77.1

## Sheet 6 of 7: RS485 interface
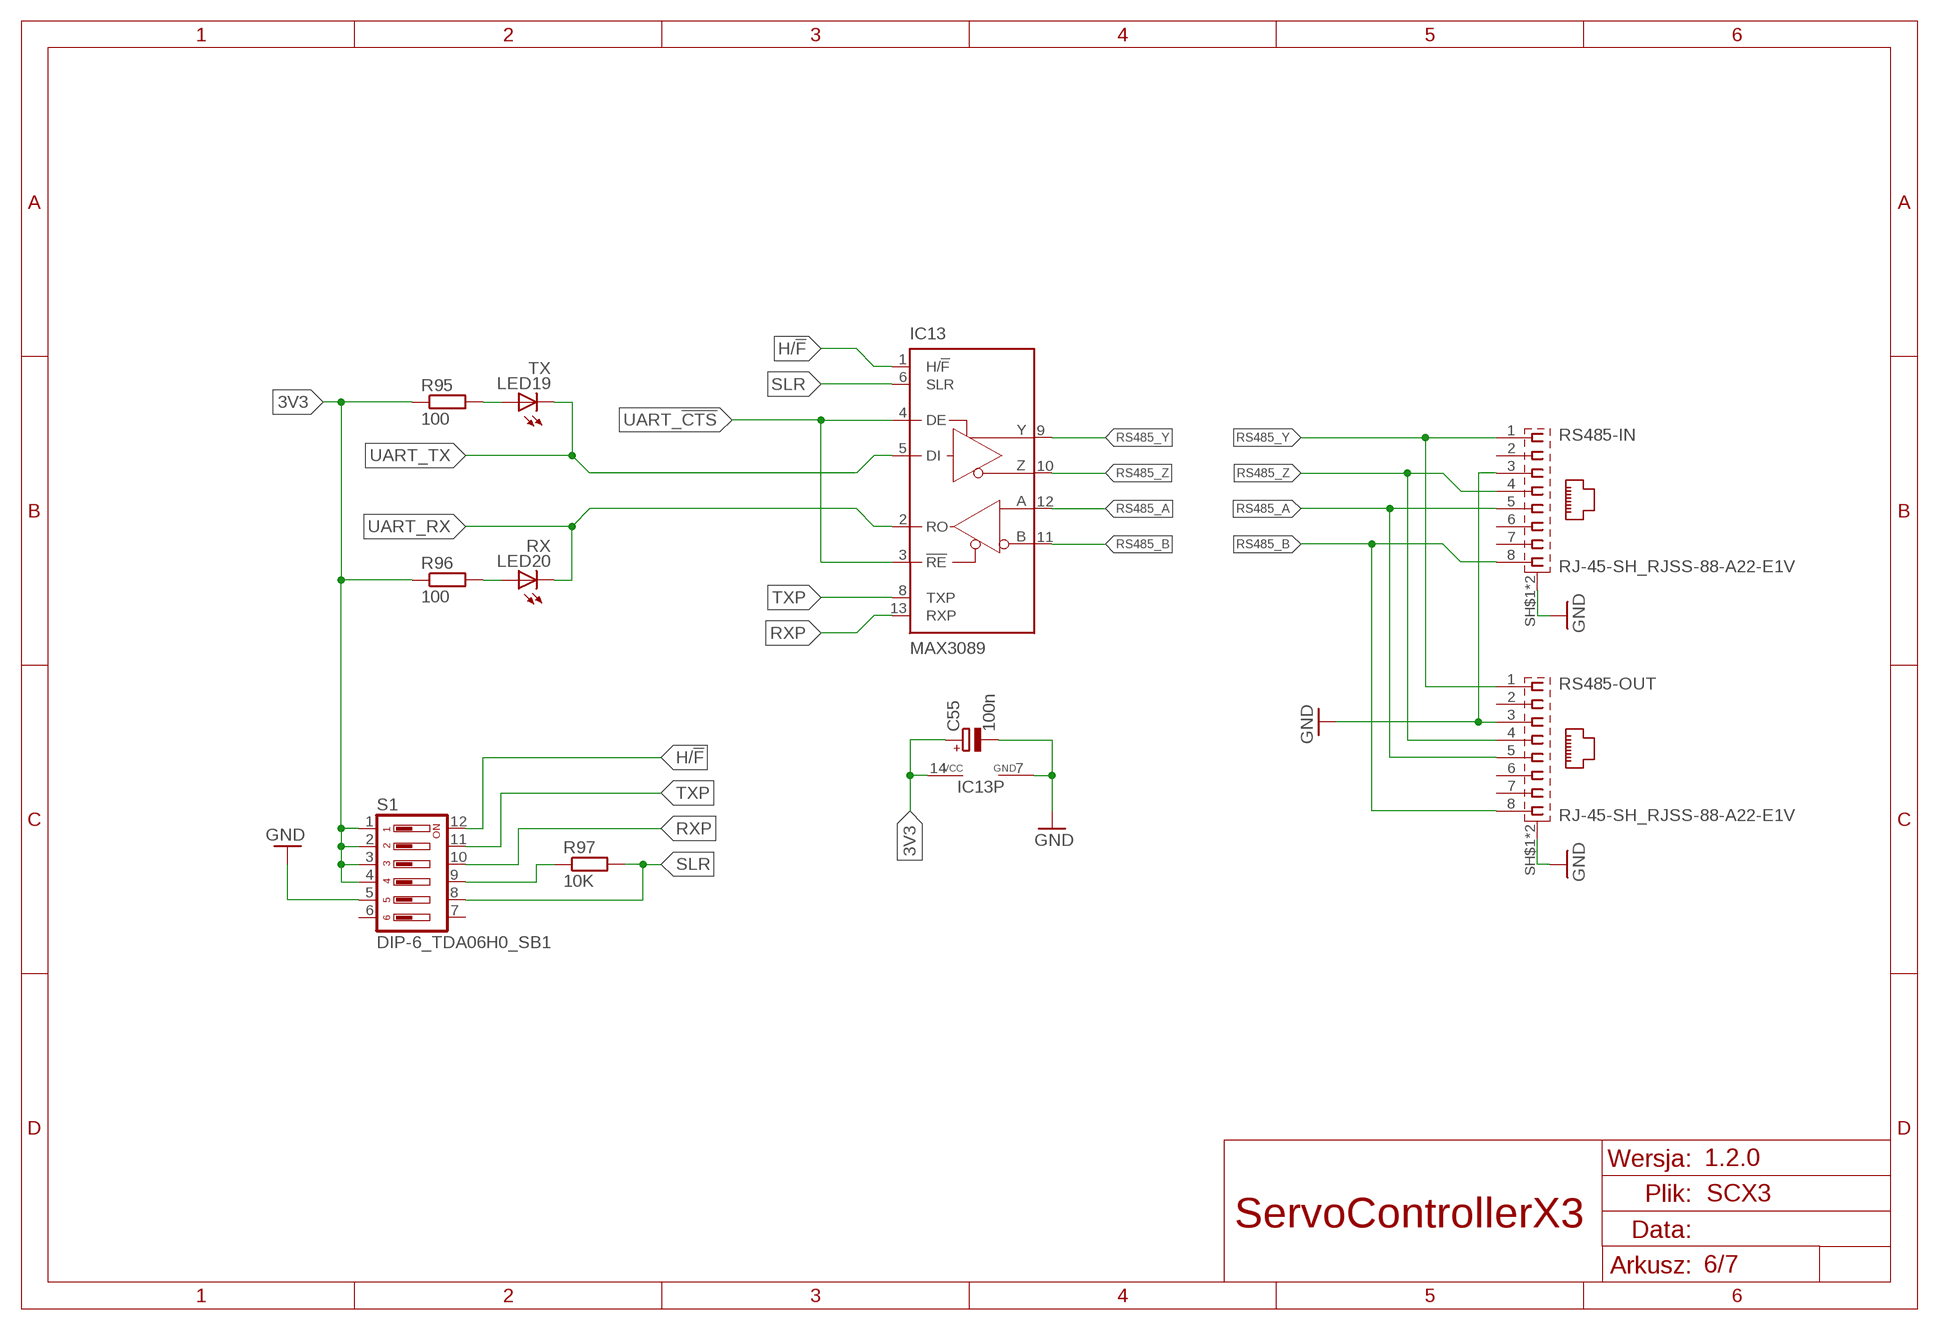
[diagram p5: schematic, sheet 6]

### Parts
C55  100n  CPOL-EUUD-4X5,8  [UD-4X5,8_NICHICON]
IC13  MAX3089  [SO14]
LED19  TX  LEDSML0603  [SML0603]
LED20  RX  LEDSML0603  [SML0603]
R95  100  R-EU_R0603  [R0603]
R96  100  R-EU_R0603  [R0603]
R97  10K  R-EU_R0603  [R0603]
RS485-IN  RJ-45-SH_RJSS-88-A22-E1V  [RJ-45M]
RS485-OUT  RJ-45-SH_RJSS-88-A22-E1V  [RJ-45M]
S1  DIP-6_TDA06H0_SB1  [TDA06H0_S]

### Nets
3V3: C55.+ IC13.14(VCC) R95.1 R96.1 S1.1 S1.2 S1.3 S1.4 ; also sheet 1,2,3,4,7
GND: C55.- IC13.7(GND) RS485-IN.3 RS485-IN.SH$1(SH) RS485-IN.SH$2(SH) RS485-OUT.3 RS485-OUT.SH$1(SH) RS485-OUT.SH$2(SH) S1.5 ; also sheet 1,2,3,4,5,7
H/!F: IC13.1(H/!F) S1.12
N$82: LED19.A R95.2
N$83: LED20.A R96.2
N$85: R97.1 S1.9
RS485_A: IC13.12(A) RS485-IN.5 RS485-OUT.5
RS485_B: IC13.11(B) RS485-IN.8 RS485-OUT.8
RS485_Y: IC13.9(Y) RS485-IN.1 RS485-OUT.1
RS485_Z: IC13.10(Z) RS485-IN.4 RS485-OUT.4
RXP: IC13.13(RXP) S1.10
SLR: IC13.6(SLR) R97.2 S1.8
TXP: IC13.8(TXP) S1.11
UART_!CTS: IC13.3(!RE) IC13.4(DE) ; also sheet 7
UART_RX: IC13.2(RO) LED20.C ; also sheet 7
UART_TX: IC13.5(DI) LED19.C ; also sheet 7
Unconnected: RS485-IN.2 RS485-IN.6 RS485-IN.7 RS485-OUT.2 RS485-OUT.6 RS485-OUT.7 S1.6 S1.7

## Sheet 7 of 7: Controller
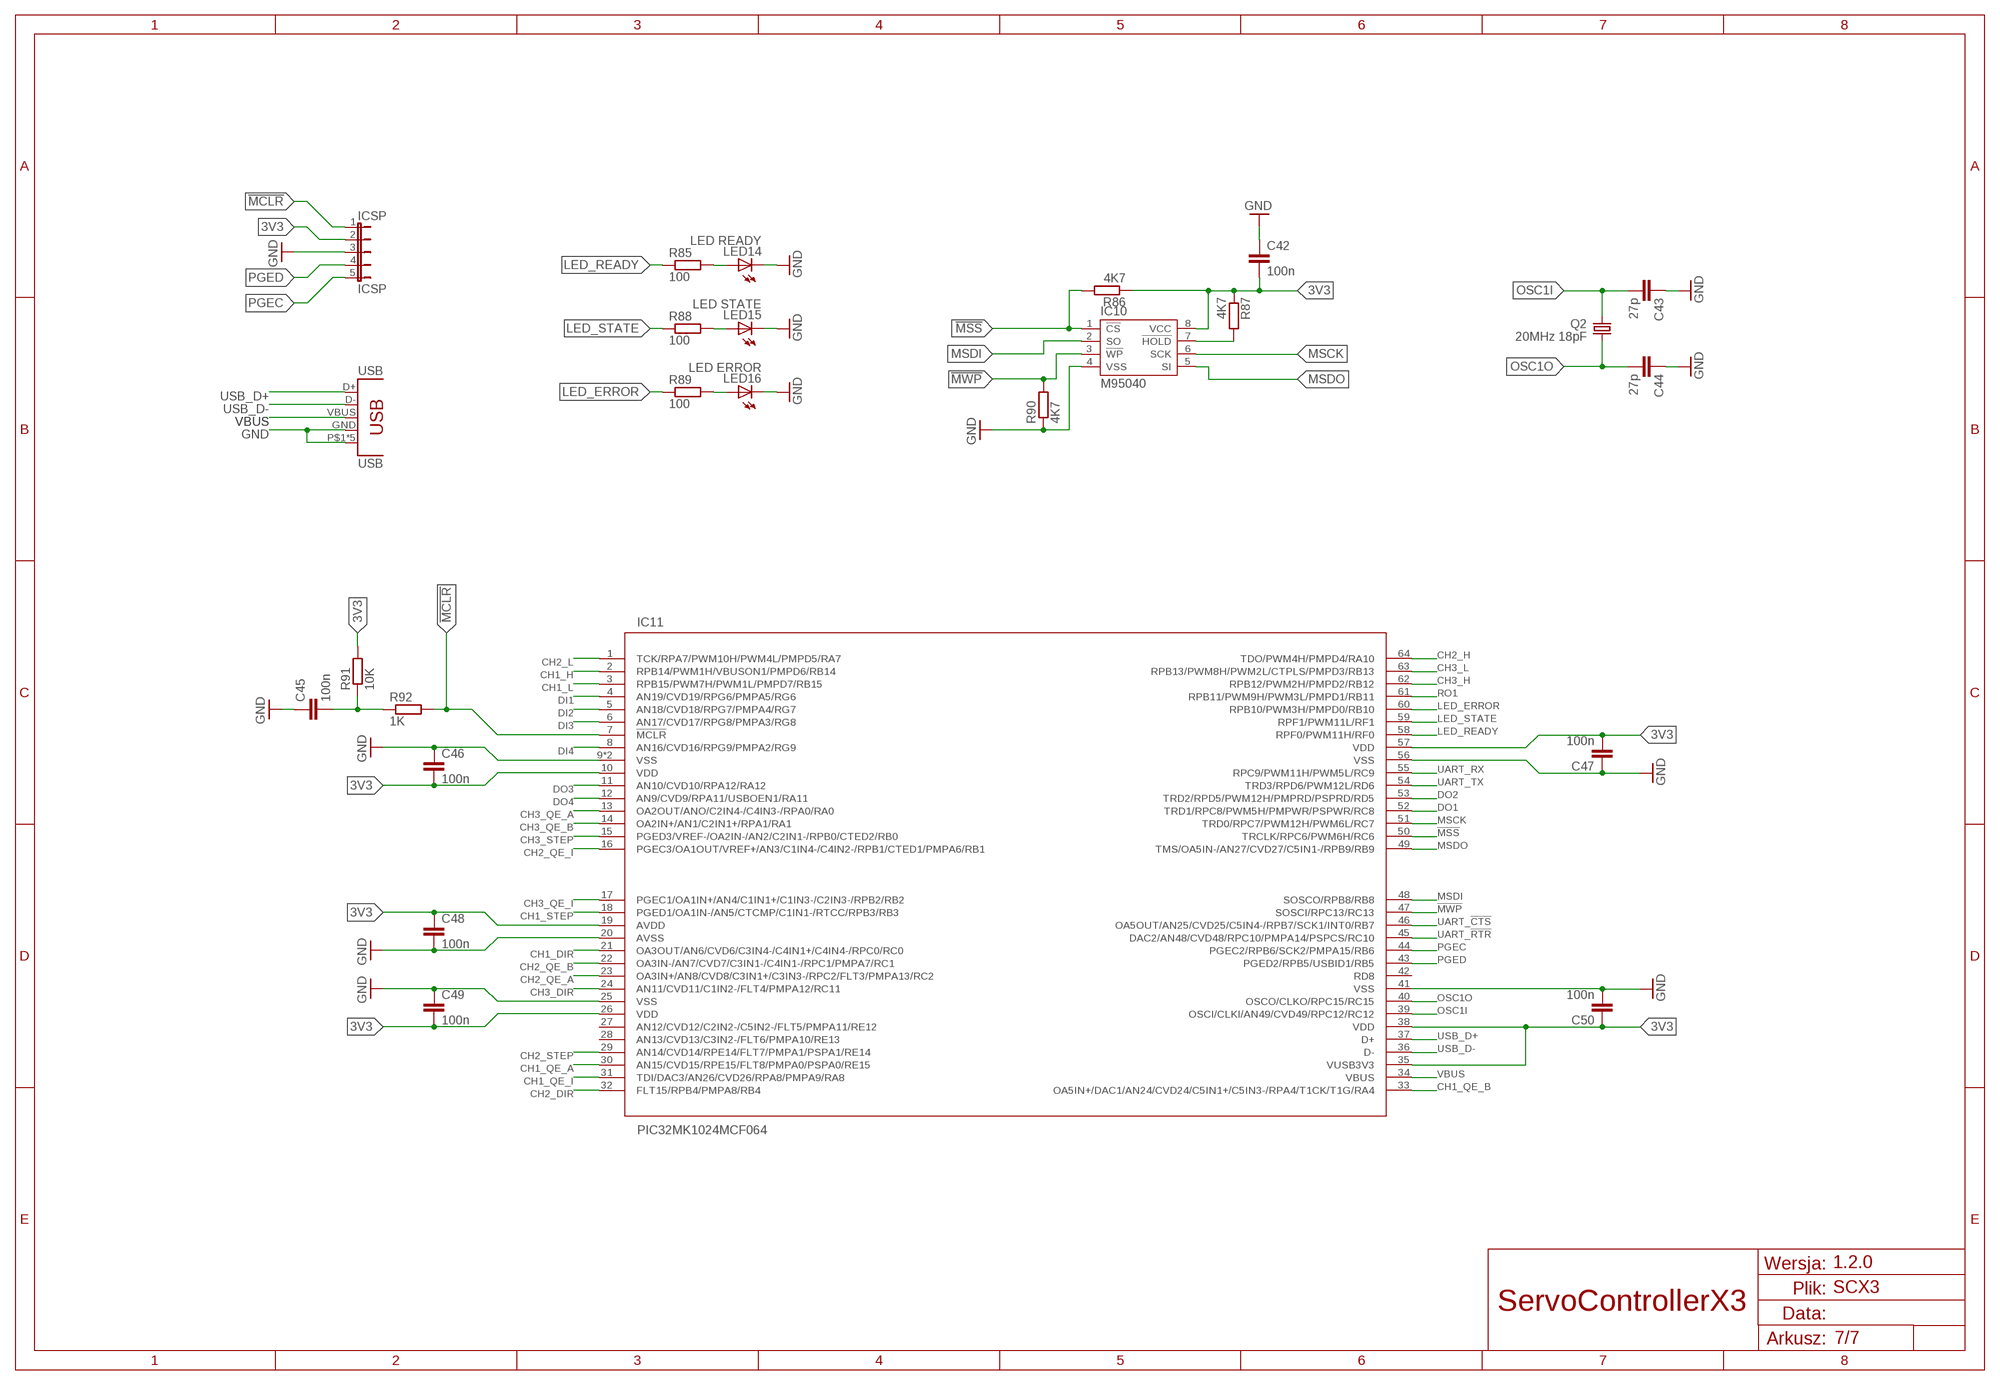
[diagram p6: schematic, sheet 7]

### Parts
C42  100n  C-EUC0805  [C0805]
C43  27p  C-EUC0805  [C0805]
C44  27p  C-EUC0805  [C0805]
C45  100n  C-EUC0805  [C0805]
C46  100n  C-EUC0805  [C0805]
C47  100n  C-EUC0805  [C0805]
C48  100n  C-EUC0805  [C0805]
C49  100n  C-EUC0805  [C0805]
C50  100n  C-EUC0805  [C0805]
IC10  M95040  [SO8]
IC11  PIC32MK1024MCF064  [QFN64-9X9]
ICSP  ICSP  JP5E  [JP5]
LED14  LED READY  LEDSML1206  [SML1206]
LED15  LED STATE  LEDSML1206  [SML1206]
LED16  LED ERROR  LEDSML1206  [SML1206]
Q2  20MHz 18pF  CRYSTALSM49  [SM49]
R85  100  R-EU_R0805  [R0805]
R86  4K7  R-EU_R0805  [R0805]
R87  4K7  R-EU_R0805  [R0805]
R88  100  R-EU_R0805  [R0805]
R89  100  R-EU_R0805  [R0805]
R90  4K7  R-EU_R0805  [R0805]
R91  10K  R-EU_R0805  [R0805]
R92  1K  R-EU_R0805  [R0805]
USB  USB  DIP-USB-B-TYPE-FMAL(4+2P-2.5-90D)  [USB-B-PTH-VERTICAL]

### Nets
3V3: C42.2 C46.2 C47.2 C48.1 C49.2 C50.1 IC10.8(VCC) IC11.10(VDD) IC11.19(AVDD) IC11.26(VDD) IC11.35(VUSB3V3) IC11.38(VDD) IC11.57(VDD) ICSP.2 R86.1 R87.1 R91.2 ; also sheet 1,2,3,4,6
!HOLD: IC10.7(!HOLD) R87.2
!MCLR: IC11.7(!MCLR) ICSP.1 R92.2
!MSS: IC10.1(!CS) IC11.50(TRCLK/RPC6/PWM6H/RC6) R86.2
!MWP: IC10.3(!WP) IC11.47(SOSCI/RPC13/RC13) R90.2
CH1_DIR: IC11.21(OA3OUT/AN6/CVD6/C3IN4-/C4IN1+/C4IN4-/RPC0/RC0) ; also sheet 3
CH1_H: IC11.2(RPB14/PWM1H/VBUSON1/PMPD6/RB14) ; also sheet 5
CH1_L: IC11.3(RPB15/PWM7H/PWM1L/PMPD7/RB15) ; also sheet 5
CH1_QE_A: IC11.30(AN15/CVD15/RPE15/FLT8/PMPA0/PSPA0/RE15) ; also sheet 4
CH1_QE_B: IC11.33(OA5IN+/DAC1/AN24/CVD24/C5IN1+/C5IN3-/RPA4/T1CK/T1G/RA4) ; also sheet 4
CH1_QE_I: IC11.31(TDI/DAC3/AN26/CVD26/RPA8/PMPA9/RA8) ; also sheet 4
CH1_STEP: IC11.18(PGED1/OA1IN-/AN5/CTCMP/C1IN1-/RTCC/RPB3/RB3) ; also sheet 3
CH2_DIR: IC11.32(FLT15/RPB4/PMPA8/RB4) ; also sheet 3
CH2_H: IC11.64(TDO/PWM4H/PMPD4/RA10) ; also sheet 5
CH2_L: IC11.1(TCK/RPA7/PWM10H/PWM4L/PMPD5/RA7) ; also sheet 5
CH2_QE_A: IC11.23(OA3IN+/AN8/CVD8/C3IN1+/C3IN3-/RPC2/FLT3/PMPA13/RC2) ; also sheet 4
CH2_QE_B: IC11.22(OA3IN-/AN7/CVD7/C3IN1-/C4IN1-/RPC1/PMPA7/RC1) ; also sheet 4
CH2_QE_I: IC11.16(PGEC3/OA1OUT/VREF+/AN3/C1IN4-/C4IN2-/RPB1/CTED1/PMPA6/RB1) ; also sheet 4
CH2_STEP [SIGNAL]: IC11.29(AN14/CVD14/RPE14/FLT7/PMPA1/PSPA1/RE14) ; also sheet 3
CH3_DIR: IC11.24(AN11/CVD11/C1IN2-/FLT4/PMPA12/RC11) ; also sheet 3
CH3_H: IC11.62(RPB12/PWM2H/PMPD2/RB12) ; also sheet 5
CH3_L: IC11.63(RPB13/PWM8H/PWM2L/CTPLS/PMPD3/RB13) ; also sheet 5
CH3_QE_A: IC11.13(OA2OUT/ANO/C2IN4-/C4IN3-/RPA0/RA0) ; also sheet 4
CH3_QE_B: IC11.14(OA2IN+/AN1/C2IN1+/RPA1/RA1) ; also sheet 4
CH3_QE_I: IC11.17(PGEC1/OA1IN+/AN4/C1IN1+/C1IN3-/C2IN3-/RPB2/RB2) ; also sheet 4
CH3_STEP: IC11.15(PGED3/VREF-/OA2IN-/AN2/C2IN1-/RPB0/CTED2/RB0) ; also sheet 3
DI1: IC11.4(AN19/CVD19/RPG6/PMPA5/RG6) ; also sheet 2
DI2: IC11.5(AN18/CVD18/RPG7/PMPA4/RG7) ; also sheet 2
DI3: IC11.6(AN17/CVD17/RPG8/PMPA3/RG8) ; also sheet 2
DI4: IC11.8(AN16/CVD16/RPG9/PMPA2/RG9) ; also sheet 2
DO1: IC11.52(TRD1/RPC8/PWM5H/PMPWR/PSPWR/RC8) ; also sheet 2
DO2: IC11.53(TRD2/RPD5/PWM12H/PMPRD/PSPRD/RD5) ; also sheet 2
DO3: IC11.11(AN10/CVD10/RPA12/RA12) ; also sheet 2
DO4: IC11.12(AN9/CVD9/RPA11/USBOEN1/RA11) ; also sheet 2
GND: C42.1 C43.1 C44.1 C45.1 C46.1 C47.1 C48.2 C49.1 C50.2 IC10.4(VSS) IC11.9(VSS) IC11.20(AVSS) IC11.25(VSS) IC11.41(VSS) IC11.56(VSS) IC11.EXP(VSS) ICSP.3 LED14.C LED15.C LED16.C R90.1 USB.GND USB.P$1 USB.P$2 USB.P$3 USB.P$4 USB.P$5 ; also sheet 1,2,3,4,5,6
LED_ERROR: IC11.60(RPB10/PWM3H/PMPD0/RB10) R89.1
LED_READY: IC11.58(RPF0/PWM11H/RF0) R85.1
LED_STATE: IC11.59(RPF1/PWM11L/RF1) R88.1
MSCK: IC10.6(SCK) IC11.51(TRD0/RPC7/PWM12H/PWM6L/RC7)
MSDI: IC10.2(SO) IC11.48(SOSCO/RPB8/RB8)
MSDO: IC10.5(SI) IC11.49(TMS/OA5IN-/AN27/CVD27/C5IN1-/RPB9/RB9)
N$45: LED14.A R85.2
N$47: LED15.A R88.2
N$48: LED16.A R89.2
N$67: C45.2 R91.1 R92.1
OSC1I: C43.2 IC11.39(OSCI/CLKI/AN49/CVD49/RPC12/RC12) Q2.2
OSC1O: C44.2 IC11.40(OSCO/CLKO/RPC15/RC15) Q2.1
PGEC: IC11.44(PGEC2/RPB6/SCK2/PMPA15/RB6) ICSP.5
PGED: IC11.43(PGED2/RPB5/USBID1/RB5) ICSP.4
RO1: IC11.61(RPB11/PWM9H/PWM3L/PMPD1/RB11) ; also sheet 2
UART_!CTS: IC11.46(OA5OUT/AN25/CVD25/C5IN4-/RPB7/SCK1/INT0/RB7) ; also sheet 6
UART_!RTR: IC11.45(DAC2/AN48/CVD48/RPC10/PMPA14/PSPCS/RC10)
UART_RX: IC11.55(RPC9/PWM11H/PWM5L/RC9) ; also sheet 6
UART_TX: IC11.54(TRD3/RPD6/PWM12L/RD6) ; also sheet 6
USB_D+: IC11.37(D+) USB.D+
USB_D-: IC11.36(D-) USB.D-
VBUS: IC11.34(VBUS) USB.VBUS
Unconnected: IC11.27(AN12/CVD12/C2IN2-/C5IN2-/FLT5/PMPA11/RE12) IC11.28(AN13/CVD13/C3IN2-/FLT6/PMPA10/RE13) IC11.42(RD8)

## Library data of the parts
C1 C2 C4-C8 C10-C12 C14-C36 C42-C50 = rcl:C-EU: CAPACITOR, European symbol
C3 C9 C13 C55 = rcl:CPOL-EU: POLARIZED CAPACITOR, European symbol
D1-D3 = diode:1N4148: DIODE high speed (Philips)
D4 = diode:ZENER-DIODE: Z-Diode
ENCODER1-ENCODER3 OUTPUT = con-subd:F09VP: SUB-D; OC_FARNELL: unknown; OC_NEWARK: unknown
F1 F2 = fuse:TR5: FUSE Wickmann; OC_FARNELL: unknown; OC_NEWARK: unknown
IC1 = MyLib:MAX604: LDO VOLTAGE REGULATOR
IC2 = uln-udn:ULN2074B: DRIVER ARRAY
IC3-IC5 = linear:LM339: Low Power Low Offset Voltage Quad Comparators with open collector; LM139/LM239/LM339/LM2901/LM3302
IC6-IC8 = MyLib:LM324: OP AMP
IC10 = MyLib:M950*: 4 Kbit, 2 Kbit and 1 Kbit serial SPI bus EEPROM with high-speed clock
IC11 = MyLib:PIC32MK1024MCF064: PIC MICROCONTROLLER
IC13 = MyLib:MAX3089: Fail-Safe, High-Speed (10Mbps), Slew-Rate-Limited RS-485/RS-422 Transceiver
ICSP = MyLib:JP5E: JUMPER
INTERFACE = con-subd:F25VP: SUB-D; OC_FARNELL: unknown; OC_NEWARK: unknown
K1 = MyLib:G6K: Low Signal Relay oeiwcsnts1.omron.com/.. D20G6K0100.pdf; MF: OMRON COMPONENTS USA; MPN: G6K-2P-Y DC12; OC_FARNELL: 3937276; OC_NEWARK: 34C3464
L1 L2 = MyLib:DJNR6028-*-S: INDUCTOR
LED1 LED2 = led:DUOLED-RG-C: DUO LED 2 colors (red/green), 5 mm, round, common Cathode www.ligitek.com or other producers.
LED3 LED5 LED6 LED8 LED14-LED16 LED19 LED20 = led:LED: LED OSRAM: - CHIPLED LG R971, LG N971, LY N971, LG Q971, LY Q971, LO R971, LY R971 LH N974, LH R974 LS Q976, LO Q976, LY Q976 LO Q996 - Hyper CHIPLED LW Q18S LB Q993, LB Q99A, LB R99A - SideLED LS A670, LO A670, LY A670, LG A670, LP A670 LB A673, LV A673, LT A673, LW A673 LH A674 LY A675 LS A676, LA A676, LO A676, LY A676, LW A676 LS A679, LY A679, LG A679 - Hyper Micro SIDELED® LS Y876, LA Y876, LO Y876, LY Y876 LT Y87S - SmartLED LW L88C, LW L88S LB L89C, LB L89S, LG L890 LS L89K, LO L89K, LY L89K LS L896, LA L896, LO L896, LY L896 - TOPLED LS T670, LO T670, LY T670, LG T670, LP T670 LSG T670, LSP T670, LSY T670, LOP T670, LYG T670 LG T671, LOG T671, LSG T671 LB T673, LV T673, LT T673, LW T673 LH T674 LS T676, LA T676, LO T676, LY T676, LB T676, LH T676, LSB T676, LW T676 LB T67C, LV T67C, LT T67C, LS T67K, LO T67K, LY T67K, LW E67C LS E67B, LA E67B, LO E67B, LY E67B, LB E67C, LV E67C, LT E67C LW T67C LS T679, LY T679, LG T679 LS T770, LO T770, LY T770, LG T770, LP T770 LB T773, LV T773, LT T773, LW T773 LH T774 LS E675, LA E675, LY E675, LS T675 LS T776, LA T776, LO T776, LY T776, LB T776 LHGB T686 LT T68C, LB T68C - Hyper Mini TOPLED® LB M676 - Mini TOPLED Santana® LG M470 LS M47K, LO M47K, LY M47K Source: http://www.osram.convergy.de LUXEON: - LUMILED® LXK2-PW12-R00, LXK2-PW12-S00, LXK2-PW14-U00, LXK2-PW14-V00 LXK2-PM12-R00, LXK2-PM12-S00, LXK2-PM14-U00 LXK2-PE12-Q00, LXK2-PE12-R00, LXK2-PE12-S00, LXK2-PE14-T00, LXK2-PE14-U00 LXK2-PB12-K00, LXK2-PB12-L00, LXK2-PB12-M00, LXK2-PB14-N00, LXK2-PB14-P00, LXK2-PB14-Q00 LXK2-PR12-L00, LXK2-PR12-M00, LXK2-PR14-Q00, LXK2-PR14-R00 LXK2-PD12-Q00, LXK2-PD12-R00, LXK2-PD12-S00 LXK2-PH12-R00, LXK2-PH12-S00 LXK2-PL12-P00, LXK2-PL12-Q00, LXK2-PL12-R00 Source: www.luxeon.com KINGBRIGHT: KA-3528ASYC Source: www.kingbright.com
OK1 = MyLib:LTV844: SHARP OPTO COUPLER
OK2-OK4 = MyLib:TLP2662F: 2 GATE 20Mbps OPTO COUPLER
POWER = con-ptr500:AK500/2: CONNECTOR; OC_FARNELL: unknown; OC_NEWARK: unknown
Q1 Q3 Q4 = transistor-npn:BC848*: NPN Transistor
Q2 = crystal:CRYSTAL: CRYSTAL; OC_FARNELL: unknown; OC_NEWARK: unknown
R2 R9 R11 R13 = rcl:R-EU_: RESISTOR, European symbol; WATTAGE: 500mW
R3 R5 R6 R8 R10 R12 R14-R92 R95-R97 = rcl:R-EU_: RESISTOR, European symbol
READY = con-ptr500:AK500/3: CONNECTOR; OC_FARNELL: unknown; OC_NEWARK: unknown
RS485-IN RS485-OUT = MyLib:RJ-45-SH
S1 = MyLib:DIP-6: Surface Mount DIP Switch Series 219 SMT CTS Electronic Components Sourc: www.ctscorp.com
SJ1-SJ10 = jumper:SJ: SMD solder JUMPER
U1 = MyLib:AM6C-*D-NZ
U2 = MyLib:AM10CW-*S-NZ: 10 Watt | 2A | DC-DC Converter; OUT-VOLTAGE: 5V
USB = MyLib:DIP-USB-B-TYPE-FMAL(4+2P-2.5-90D): 320010018

## Net classes
0 default: clearance 0.205 mm
1 3.3V: clearance 0.2 mm
2 5V: clearance 0.2 mm
3 12V: clearance 0.205 mm to class 0, clearance 0.205 mm to class 1, clearance 0.205 mm to class 2, clearance 0.205 mm
4 24V: clearance 0.205 mm to class 0, clearance 0.205 mm to class 1, clearance 0.205 mm to class 2, clearance 0.205 mm to class 3, clearance 0.205 mm
5 SIGNAL: clearance 0.205 mm to class 0, clearance 0.205 mm to class 1, clearance 0.205 mm to class 2, clearance 0.205 mm to class 3, clearance 1 mm to class 4, clearance 0.205 mm
6 PWR: clearance 0.2 mm